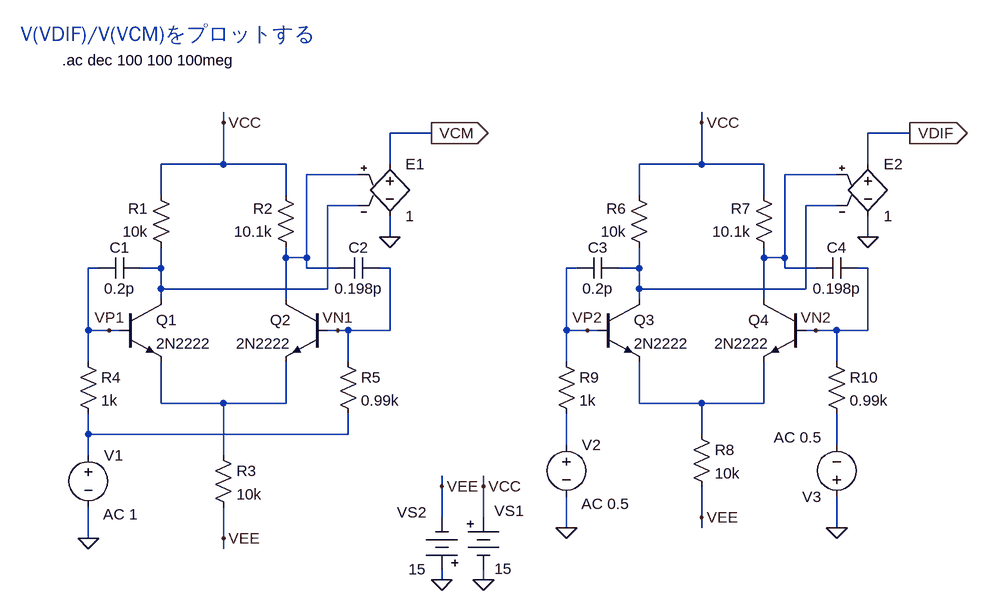
[diagram p0: schematic fig-02-03-31.asc]
fig-02-03-31.asc, the LTspice schematic file:
Version 4
SHEET 1 1040 692
WIRE -400 -272 -400 -288
WIRE 336 -272 336 -288
WIRE -80 -256 -144 -256
WIRE 656 -256 592 -256
WIRE -400 -208 -400 -272
WIRE -400 -208 -496 -208
WIRE -304 -208 -400 -208
WIRE -144 -208 -144 -256
WIRE 336 -208 336 -272
WIRE 336 -208 240 -208
WIRE 432 -208 336 -208
WIRE 592 -208 592 -256
WIRE -192 -192 -272 -192
WIRE 544 -192 464 -192
WIRE -496 -160 -496 -208
WIRE -304 -160 -304 -208
WIRE 240 -160 240 -208
WIRE 432 -160 432 -208
WIRE -192 -144 -240 -144
WIRE 544 -144 496 -144
WIRE -144 -96 -144 -128
WIRE 592 -96 592 -128
WIRE -304 -64 -304 -80
WIRE -272 -64 -272 -192
WIRE -272 -64 -304 -64
WIRE 432 -64 432 -80
WIRE 464 -64 464 -192
WIRE 464 -64 432 -64
WIRE -592 -48 -608 -48
WIRE -496 -48 -496 -80
WIRE -496 -48 -528 -48
WIRE -272 -48 -272 -64
WIRE -224 -48 -272 -48
WIRE -144 -48 -160 -48
WIRE 144 -48 128 -48
WIRE 240 -48 240 -80
WIRE 240 -48 208 -48
WIRE 464 -48 464 -64
WIRE 512 -48 464 -48
WIRE 592 -48 576 -48
WIRE -496 -16 -496 -48
WIRE -240 -16 -240 -144
WIRE -240 -16 -496 -16
WIRE 240 -16 240 -48
WIRE 496 -16 496 -144
WIRE 496 -16 240 -16
WIRE -496 0 -496 -16
WIRE -304 0 -304 -64
WIRE 240 0 240 -16
WIRE 432 0 432 -64
WIRE -608 48 -608 -48
WIRE -576 48 -608 48
WIRE -560 48 -576 48
WIRE -224 48 -240 48
WIRE -208 48 -224 48
WIRE -144 48 -144 -48
WIRE -144 48 -208 48
WIRE 128 48 128 -48
WIRE 160 48 128 48
WIRE 176 48 160 48
WIRE 512 48 496 48
WIRE 544 48 512 48
WIRE 592 48 592 -48
WIRE 592 48 544 48
WIRE -608 96 -608 48
WIRE -208 96 -208 48
WIRE 128 96 128 48
WIRE 544 96 544 48
WIRE -496 160 -496 96
WIRE -400 160 -496 160
WIRE -304 160 -304 96
WIRE -304 160 -400 160
WIRE 240 160 240 96
WIRE 336 160 240 160
WIRE 432 160 432 96
WIRE 432 160 336 160
WIRE -608 208 -608 176
WIRE -208 208 -208 176
WIRE -208 208 -608 208
WIRE 336 208 336 160
WIRE 128 224 128 176
WIRE 544 224 544 176
WIRE -608 240 -608 208
WIRE -400 240 -400 160
WIRE -64 288 -64 272
WIRE 0 288 0 272
WIRE -64 336 -64 288
WIRE 0 336 0 288
WIRE 336 336 336 288
WIRE 128 352 128 304
WIRE 336 352 336 336
WIRE 544 352 544 304
WIRE -608 368 -608 320
WIRE -400 368 -400 320
WIRE -400 384 -400 368
WIRE -64 432 -64 416
WIRE 0 432 0 416
FLAG -608 368 0
FLAG -64 432 0
FLAG 0 432 0
FLAG -64 288 VEE
FLAG 0 288 VCC
FLAG -400 368 VEE
FLAG -400 -272 VCC
FLAG -576 48 VP1
FLAG -224 48 VN1
FLAG 128 352 0
FLAG 656 -256 VDIF
IOPIN 656 -256 Out
FLAG 336 336 VEE
FLAG 336 -272 VCC
FLAG 544 352 0
FLAG 160 48 VP2
FLAG 512 48 VN2
FLAG -80 -256 VCM
IOPIN -80 -256 Out
FLAG -144 -96 0
FLAG 592 -96 0
SYMBOL Misc\\battery 0 320 R0
WINDOW 0 17 6 Left 2
WINDOW 3 17 95 Left 2
SYMATTR InstName VS1
SYMATTR Value 15
SYMBOL Misc\\battery -64 432 R180
WINDOW 0 24 104 Left 2
WINDOW 3 24 16 Left 2
SYMATTR InstName VS2
SYMATTR Value 15
SYMBOL res -480 -64 R180
WINDOW 0 36 76 Left 2
WINDOW 3 36 40 Left 2
SYMATTR InstName R1
SYMATTR Value 10k
SYMBOL npn -560 0 R0
SYMATTR InstName Q1
SYMATTR Value 2N2222
SYMBOL npn -240 0 M0
SYMATTR InstName Q2
SYMATTR Value 2N2222
SYMBOL res -288 -64 R180
WINDOW 0 36 76 Left 2
WINDOW 3 36 40 Left 2
SYMATTR InstName R2
SYMATTR Value 10.1k
SYMBOL res -416 224 R0
SYMATTR InstName R3
SYMATTR Value 10k
SYMBOL res 256 -64 R180
WINDOW 0 36 76 Left 2
WINDOW 3 36 40 Left 2
SYMATTR InstName R6
SYMATTR Value 10k
SYMBOL npn 176 0 R0
SYMATTR InstName Q3
SYMATTR Value 2N2222
SYMBOL npn 496 0 M0
SYMATTR InstName Q4
SYMATTR Value 2N2222
SYMBOL res 448 -64 R180
WINDOW 0 36 76 Left 2
WINDOW 3 36 40 Left 2
SYMATTR InstName R7
SYMATTR Value 10.1k
SYMBOL res 320 192 R0
SYMATTR InstName R8
SYMATTR Value 10k
SYMBOL e -144 -224 R0
SYMATTR InstName E1
SYMATTR Value 1
SYMBOL e 592 -224 R0
SYMATTR InstName E2
SYMATTR Value 1
SYMBOL cap -528 -64 R90
WINDOW 0 0 32 VBottom 2
WINDOW 3 32 32 VTop 2
SYMATTR InstName C1
SYMATTR Value 0.2p
SYMBOL cap -160 -64 R90
WINDOW 0 0 32 VBottom 2
WINDOW 3 32 32 VTop 2
SYMATTR InstName C2
SYMATTR Value 0.198p
SYMBOL cap 208 -64 R90
WINDOW 0 0 32 VBottom 2
WINDOW 3 32 32 VTop 2
SYMATTR InstName C3
SYMATTR Value 0.2p
SYMBOL cap 576 -64 R90
WINDOW 0 0 32 VBottom 2
WINDOW 3 32 32 VTop 2
SYMATTR InstName C4
SYMATTR Value 0.198p
SYMBOL voltage -608 224 R0
WINDOW 123 23 107 Left 2
WINDOW 39 0 0 Left 0
SYMATTR Value2 AC 1
SYMATTR InstName V1
SYMATTR Value ""
SYMBOL voltage 128 208 R0
WINDOW 123 23 107 Left 2
WINDOW 39 0 0 Left 0
SYMATTR Value2 AC 0.5
SYMATTR InstName V2
SYMATTR Value ""
SYMBOL voltage 544 320 R180
WINDOW 123 23 107 Left 2
WINDOW 39 0 0 Left 0
SYMATTR Value2 AC 0.5
SYMATTR InstName V3
SYMATTR Value ""
SYMBOL res -624 80 R0
SYMATTR InstName R4
SYMATTR Value 1k
SYMBOL res -224 80 R0
SYMATTR InstName R5
SYMATTR Value 0.99k
SYMBOL res 112 80 R0
SYMATTR InstName R9
SYMATTR Value 1k
SYMBOL res 528 80 R0
SYMATTR InstName R10
SYMATTR Value 0.99k
TEXT -648 -368 Left 2 !.ac dec 100 100 100meg
TEXT -712 -408 Left 3 ;V(VDIF)/V(VCM)をプロットする

The netlist it stands for:
* fig-02-03-31.asc
VS1 VCC 0 15
VS2 0 VEE 15
R1 N003 VCC 10k
Q1 N003 VP1 N005 0 2N2222
Q2 N001 VN1 N005 0 2N2222
R2 N001 VCC 10.1k
R3 N005 VEE 10k
R6 N004 VCC 10k
Q3 N004 VP2 N006 0 2N2222
Q4 N002 VN2 N006 0 2N2222
R7 N002 VCC 10.1k
R8 N006 VEE 10k
E1 VCM 0 N001 N003 1
E2 VDIF 0 N002 N004 1
C1 N003 VP1 0.2p
C2 VN1 N001 0.198p
C3 N004 VP2 0.2p
C4 VN2 N002 0.198p
V1 N007 0 AC 1
V2 N008 0 AC 0.5
V3 0 N009 AC 0.5
R4 VP1 N007 1k
R5 VN1 N007 0.99k
R9 VP2 N008 1k
R10 VN2 N009 0.99k
.model NPN NPN
.model PNP PNP
.lib standard.bjt
.ac dec 100 100 100meg
* V(VDIF)/V(VCM)をプロットする
.backanno
.end